# Altium project DM1097_R0M0E0.PrjPcb (part 3 of 7)
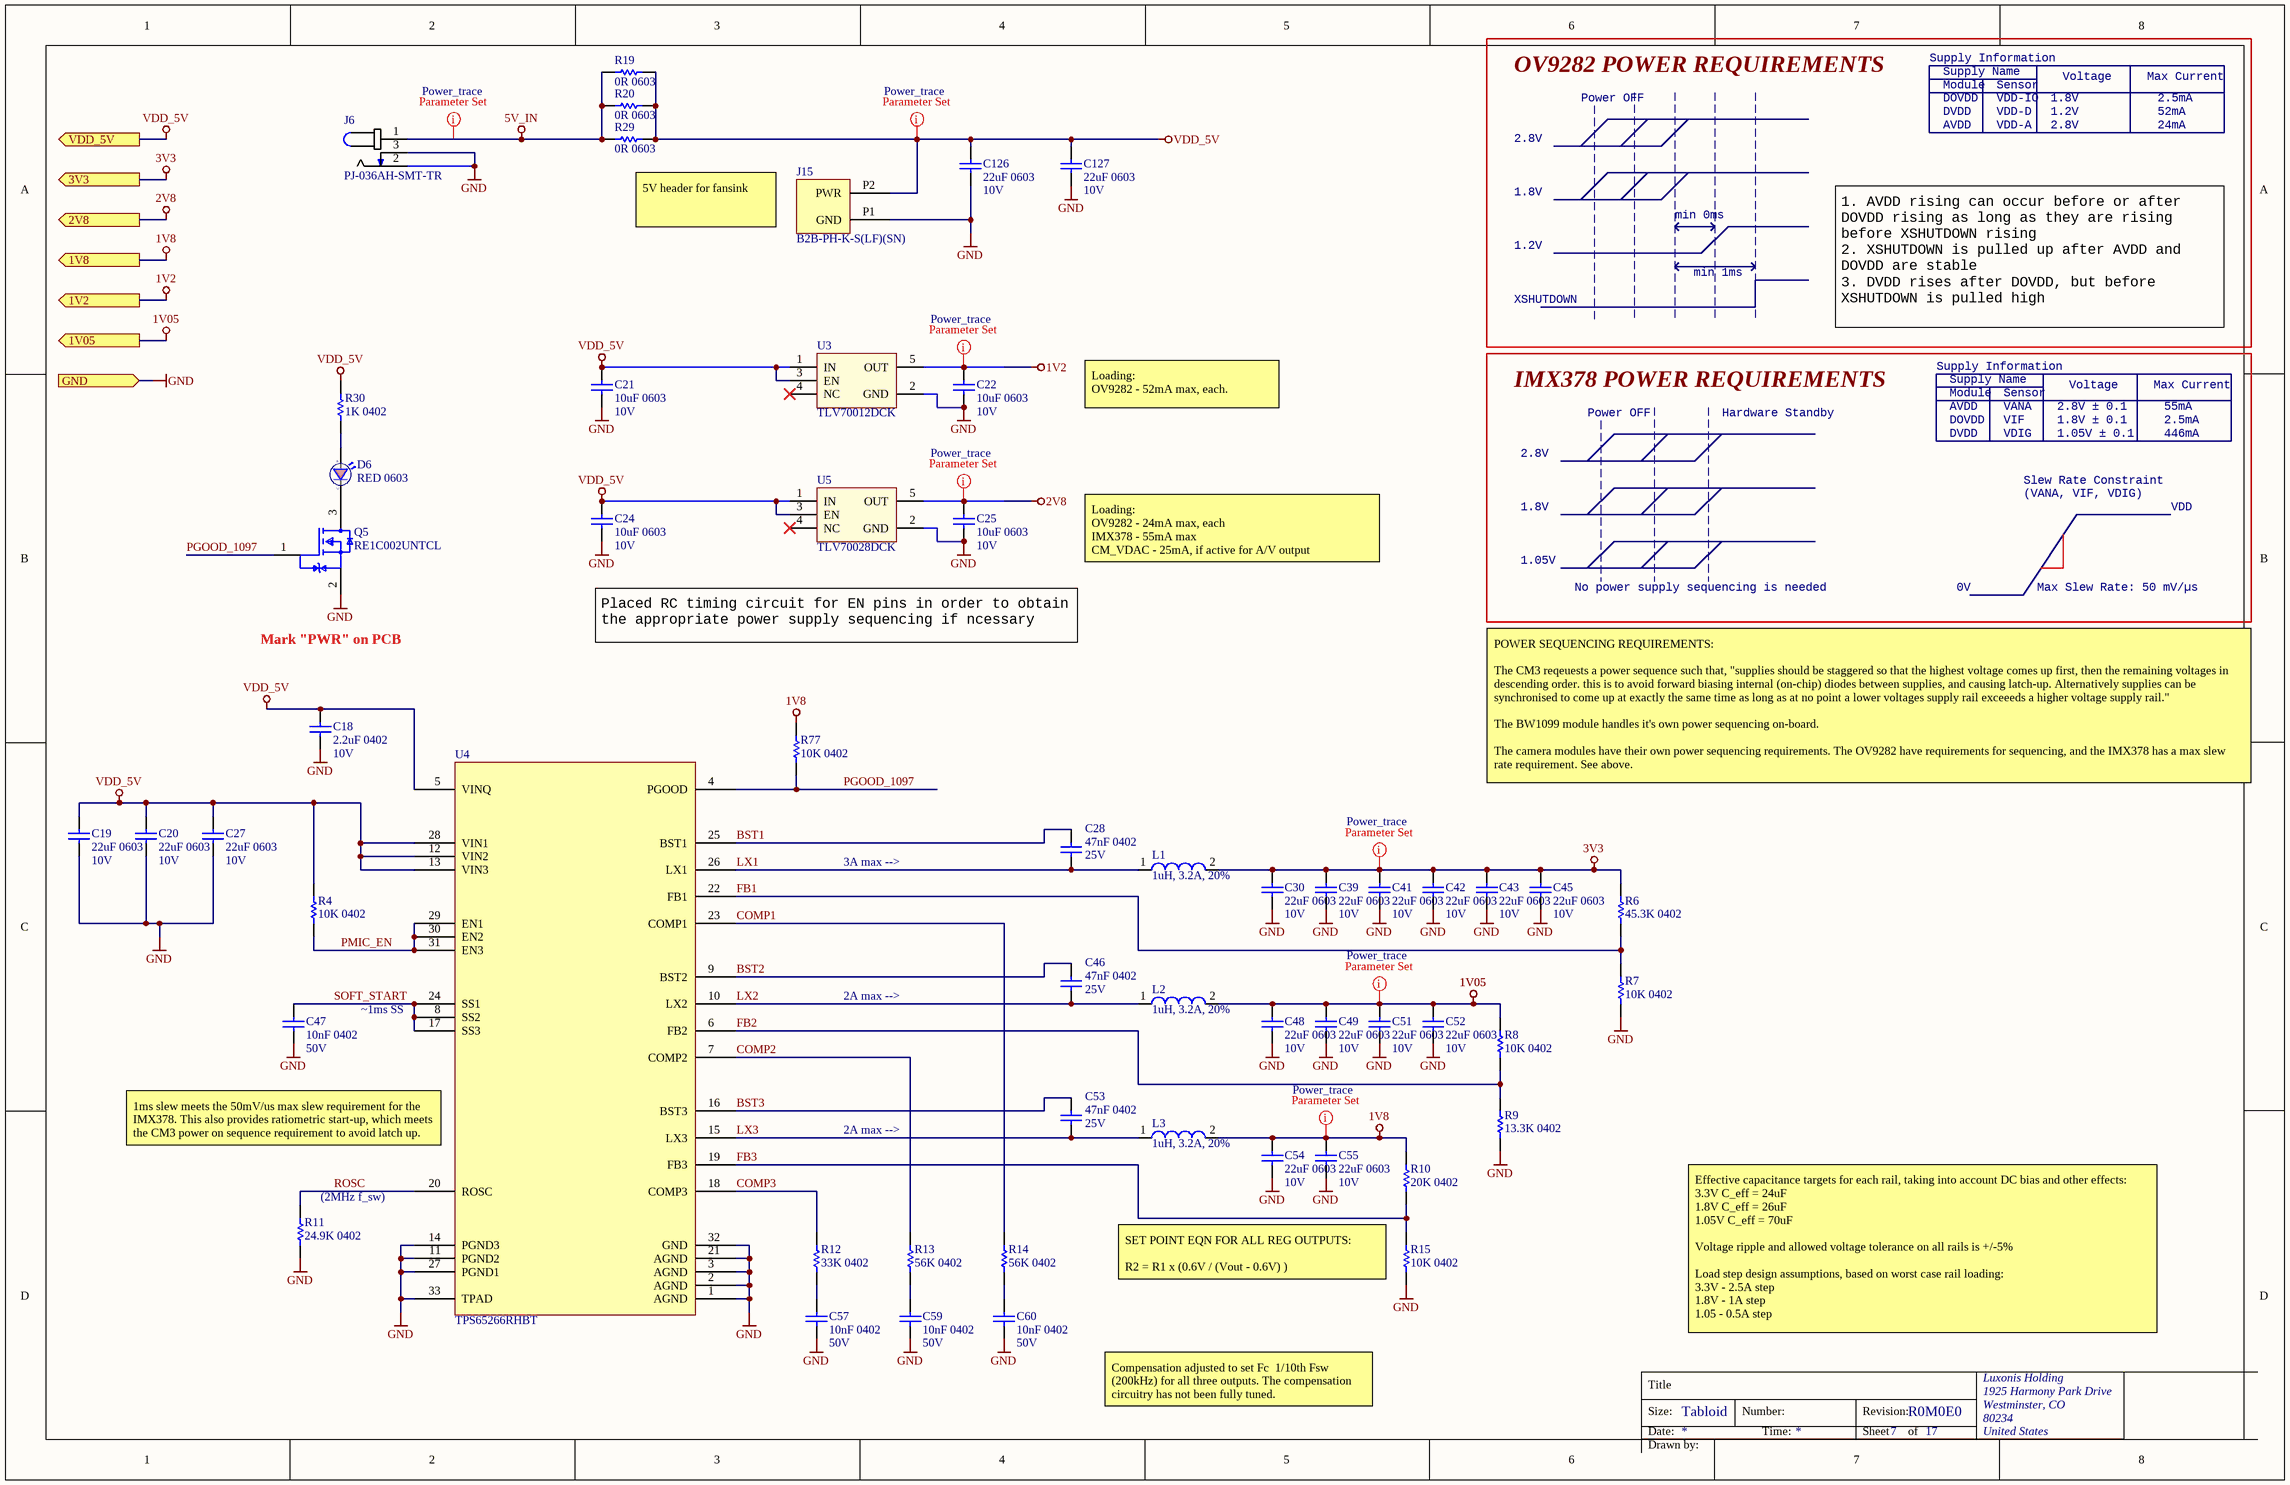
[diagram p12: DM1097_Power_Supply.SchDoc]

## Sheet DM1097_Power_Supply.SchDoc: =project_title (continued)

### Library data of the parts (continued)
U3 = TLV70012DCK: IC REG LINEAR 1.2V 200MA SC70-5; Manufacturer 1: Texas Instruments; Manufacturer Part Number 1: TLV70012DCKR; Max Power Dissipation: 320mW; Number of Outputs: 1; Dropout Voltage: 175mV; Max Input Voltage: 5.5V; Min Input Voltage: 2V; Min Current Limit: 220mA; Polarity: Positive; Accuracy: 2%; Quiescent Current: 30uA; Output Type: Fixed; Supplier 1: Digi-Key; Stock 1: 8389; Pricing 1: 1=0.48000, 10=0.40900, 100=0.30570, 500=0.24020, 1000=0.18561 (USD); RoHS: Yes; Case/Package: SC; Number of Pins: 5; Contact Plating: Gold; Min Operating Temperature: -40°C; Max Operating Temperature: 125°C; Output Voltage: 1.2V; Packaging: Tape and Reel; Output Current: 200mA; Package Quantity: 1; Max Output Current: 200mA; Number of Regulators: 1; Power Dissipation: 320mW; Min Output Voltage: 1.2V; Output Voltage Accuracy: 2%; Max Output Voltage: 1.2V; Nominal Output Voltage: 1.2V; Radiation Hardening: No; Lead Free: Lead Free; REACH SVHC: No SVHC; ComponentLink1URL: https://datasheet.ciiva.com/26909/tlv70012dckr-26909420.pdf?src-supplier=IIIC; ComponentLink1Description: https://datasheet.ciiva.com/26909/tlv70012dckr-26909420.pdf?src-supplier=IIIC; ComponentLink2URL: https://datasheet.ciiva.com/46448/1836520-46448747.pdf?src-supplier=Element14; ComponentLink2Description: https://datasheet.ciiva.com/46448/1836520-46448747.pdf?src-supplier=Element14; Supplier Part Number 1: 296-27438-1-ND; Supplier 2: TI store; Manufacturer 2: Texas Instruments; Manufacturer Part Number 2: TLV70012DCKT; Stock 2: 250; Pricing 2: 1=0.43000, 10=0.38000, 25=0.35000, 100=0.30000, 250=0.27000, 500=0.21000, 750=0.16000, 1000=0.14000 (USD); ComponentLink3URL: http://components.arrow.com/part/dataview/48874348S9524109N7713?src-supplier=Arrow; ComponentLink3Description: http://components.arrow.com/part/dataview/48874348S9524109N7713?src-supplier=Arrow; ComponentLink4URL: http://components.arrow.com/part/dataview/0323_02210905?src-supplier=Arrow+Europe; ComponentLink4Description: http://components.arrow.com/part/dataview/0323_02210905?src-supplier=Arrow+Europe; ComponentLink5URL: http://www.ti.com/general/docs/lit/getliterature.tsp?genericPartNumber=TLV700&&fileType=pdf&src-supplier=Avnet; ComponentLink5Description: http://www.ti.com/general/docs/lit/getliterature.tsp?genericPartNumber=TLV700&&fileType=pdf&src-supplier=Avnet; ComponentLink6URL: http://focus.ti.com/lit/ds/symlink/tlv70033.pdf?src-supplier=Avnet; ComponentLink6Description: http://focus.ti.com/lit/ds/symlink/tlv70033.pdf?src-supplier=Avnet; ComponentLink7URL: http://www.ti.com/lit/ds/slvsa00e/slvsa00e.pdf?src-supplier=Digi-Key; ComponentLink7Description: http://www.ti.com/lit/ds/slvsa00e/slvsa00e.pdf?src-supplier=Digi-Key; ComponentLink8URL: http://www.ti.com/litv/slvsa00d?src-supplier=Mouser; ComponentLink8Description: http://www.ti.com/litv/slvsa00d?src-supplier=Mouser; Supplier Part Number 2: TLV70012DCKT
U4 = TPS65266RHBT: IC REG BCK ADJ 3A/2A TRPL 32VQFN Buck Switching Regulator IC Positive Adjustable 0.6V 3 Output 3A, 2A 32-VFQFN Exposed Pad; Manufacturer 1: Texas Instruments; Manufacturer: TI; Switching Frequency: 2.4MHz; Number of Outputs: 3; Min Input Voltage: 2.7V; Max Input Voltage: 6.5V; Min Output Voltage: 600mV; Synchronous Rectifier: Yes; Quiescent Current: 340uA; Manufacturer Part Number 1: TPS65266RHBT; Manufacturer PN: TPS65266; Package: 32-VQFN; Supplier 1: Digi-Key; Stock 1: 4557; Pricing 1: 1=4.01000, 10=3.59900, 100=2.94850 (USD); RoHS: Yes; Mount: Surface Mount; Case/Package: VQFN; Number of Pins: 32; Weight: 0.002547oz; Min Operating Temperature: -40°C; Max Operating Temperature: 85°C; Packaging: Tape and Reel; Output Current: 2A; Package Quantity: 250; Max Output Voltage: 6.5V; Operating Supply Voltage: 6.5V; Output Type: Adjustable; Output Configuration: Positive; Current - Output 1: 3A; Current - Output 2: 2A; Lead Free: Lead Free; REACH SVHC: No SVHC; ComponentLink1URL: http://www.ti.com/general/docs/lit/getliterature.tsp?genericPartNumber=TPS65266&&fileType=pdf&src-supplier=Element14; ComponentLink1Description: http://www.ti.com/general/docs/lit/getliterature.tsp?genericPartNumber=TPS65266&&fileType=pdf&src-supplier=Element14; ComponentLink2URL: http://www.ti.com/general/docs/lit/getliterature.tsp?genericPartNumber=TPS65266&amp;&amp;fileType=pdf&src-supplier=Farnell; ComponentLink2Description: http://www.ti.com/general/docs/lit/getliterature.tsp?genericPartNumber=TPS65266&amp;&amp;fileType=pdf&src-supplier=Farnell; ComponentLink3URL: http://www.ti.com/general/docs/lit/getliterature.tsp?genericPartNumber=TPS65266&&fileType=pdf&src-supplier=Farnell; ComponentLink3Description: http://www.ti.com/general/docs/lit/getliterature.tsp?genericPartNumber=TPS65266&&fileType=pdf&src-supplier=Farnell; ComponentLink4URL: http://www.ti.com/lit/ds/symlink/tps65266.pdf?src-supplier=Digi-Key; ComponentLink4Description: http://www.ti.com/lit/ds/symlink/tps65266.pdf?src-supplier=Digi-Key; ComponentLink5URL: http://www.ti.com/lit/gpn/tps65266?src-supplier=Mouser; ComponentLink5Description: http://www.ti.com/lit/gpn/tps65266?src-supplier=Mouser; ComponentLink6URL: http://www.ti.com/general/docs/lit/getliterature.tsp?genericPartNumber=TPS65266&&fileType=pdf&src-supplier=Avnet; ComponentLink6Description: http://www.ti.com/general/docs/lit/getliterature.tsp?genericPartNumber=TPS65266&&fileType=pdf&src-supplier=Avnet; Supplier Part Number 1: 296-38685-1-ND; Supplier 2: TI store; Supplier 3: Mouser; Supplier Part Number 2: TPS65266RHBT; Supplier Part Number 3: 595-TPS65266RHBT
U5 = TLV70028DCK: IC REG LINEAR 2.8V 200MA SC70-5 Linear Voltage Regulator IC  1 Output  200mA SC-70-5; Manufacturer 1: Texas Instruments; Manufacturer Part Number 1: TLV70028DCKT; Dropout Voltage: 175mV; Number of Outputs: 1; Max Power Dissipation: 320mW; Max Input Voltage: 5.5V; Min Input Voltage: 2V; Min Current Limit: 220mA; Polarity: Positive; Quiescent Current: 30uA; Accuracy: 2%; Output Type: Fixed; Nominal Supply Current: 31uA; Supplier 1: Digi-Key; Stock 1: 832; Pricing 1: 1=0.55000, 10=0.46700, 100=0.34900 (USD); RoHS: Yes; Case/Package: SC; Number of Pins: 5; Contact Plating: Gold; Min Operating Temperature: -40°C; Max Operating Temperature: 125°C; Package Quantity: 1; Packaging: Tape and Reel; Output Current: 200mA; Output Voltage: 2.8V; Max Output Current: 200mA; Number of Regulators: 1; Power Dissipation: 320mW; Min Output Voltage: 2.8V; Output Voltage Accuracy: 2%; Max Output Voltage: 2.8V; Max Supply Voltage: 5.5V; Min Supply Voltage: 2V; Nominal Output Voltage: 2.8V; Power Rating: 320mW; Termination: SMD/SMT; Length: 2.15mm; Height: 1mm; Width: 1.4mm; Radiation Hardening: No; Lead Free: Lead Free; REACH SVHC: No SVHC; ComponentLink1URL: https://datasheet.ciiva.com/14149/tlv700-eng-ds-14149840.pdf?src-supplier=Distrelec; ComponentLink1Description: https://datasheet.ciiva.com/14149/tlv700-eng-ds-14149840.pdf?src-supplier=Distrelec; ComponentLink2URL: https://datasheet.ciiva.com/22700/1882059-22700172.pdf?src-supplier=Element14; ComponentLink2Description: https://datasheet.ciiva.com/22700/1882059-22700172.pdf?src-supplier=Element14; Supplier 2: Digi-Key; Manufacturer 2: Texas Instruments; Manufacturer Part Number 2: TLV70028DCKR; Stock 2: 30013; Pricing 2: 1=0.48000, 10=0.40900, 100=0.30570, 500=0.24020, 1000=0.18561 (USD); ComponentLink3URL: http://components.arrow.com/part/dataview/0323_00585634?src-supplier=Arrow+Europe; ComponentLink3Description: http://components.arrow.com/part/dataview/0323_00585634?src-supplier=Arrow+Europe; ComponentLink4URL: http://focus.ti.com/lit/ds/symlink/tlv70033.pdf?src-supplier=Avnet+Europe; ComponentLink4Description: http://focus.ti.com/lit/ds/symlink/tlv70033.pdf?src-supplier=Avnet+Europe; ComponentLink5URL: http://www.ti.com/lit/ds/slvsa00d/slvsa00d.pdf?src-supplier=Digi-Key; ComponentLink5Description: http://www.ti.com/lit/ds/slvsa00d/slvsa00d.pdf?src-supplier=Digi-Key; ComponentLink6URL: http://www.ti.com/lit/pdf/slyy050?src-supplier=Digi-Key; ComponentLink6Description: http://www.ti.com/lit/pdf/slyy050?src-supplier=Digi-Key; ComponentLink7URL: http://www.ti.com/general/docs/lit/getliterature.tsp?genericPartNumber=TLV700&&fileType=pdf&src-supplier=Avnet+Asia; ComponentLink7Description: http://www.ti.com/general/docs/lit/getliterature.tsp?genericPartNumber=TLV700&&fileType=pdf&src-supplier=Avnet+Asia; ComponentLink8URL: http://www.ti.com/general/docs/lit/getliterature.tsp?genericPartNumber=TLV700&&fileType=pdf&src-supplier=Avnet; ComponentLink8Description: http://www.ti.com/general/docs/lit/getliterature.tsp?genericPartNumber=TLV700&&fileType=pdf&src-supplier=Avnet; ComponentLink9URL: http://components.arrow.com/part/dataview/48329233S8322732N7713?src-supplier=Arrow; ComponentLink9Description: http://components.arrow.com/part/dataview/48329233S8322732N7713?src-supplier=Arrow; ComponentLink10URL: http://www.ti.com/litv/slvsa00d?src-supplier=Mouser; ComponentLink10Description: http://www.ti.com/litv/slvsa00d?src-supplier=Mouser; ComponentLink11URL: http://www.ti.com/lit/ds/slvsa00e/slvsa00e.pdf?src-supplier=Digi-Key; ComponentLink11Description: http://www.ti.com/lit/ds/slvsa00e/slvsa00e.pdf?src-supplier=Digi-Key; Supplier Part Number 1: 296-25271-1-ND; Supplier Part Number 2: 296-39279-1-ND

## Sheet DM1097_AV.SchDoc: =project_title
size Tabloid; CompanyName: Luxonis Holding; DrawnBy: David Malovrh; Organization: Luxonis Holding; Address1: 1925 Harmony Park Drive; Address2: Westminster, CO; Address3: 80234; Address4: United States; DocumentNumber: D0000200; Revision: R0M0E0; SheetNumber: 17; SheetTotal: 17
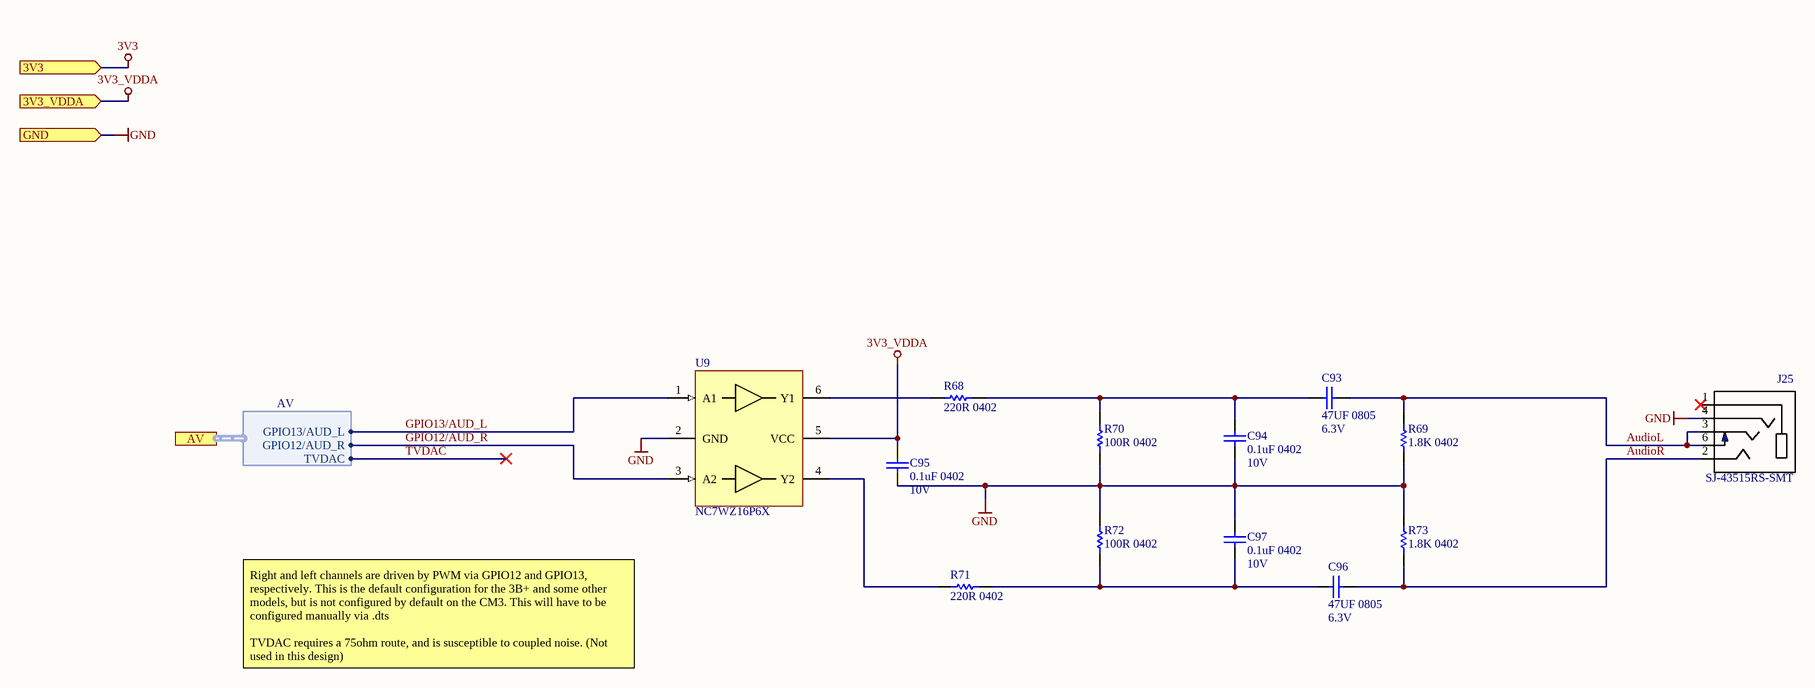
[diagram p1: DM1097_AV.SchDoc]

### Parts
C93  47UF 0805  Voltage: 6.3V  [CAPC0805(2012)145_N]
C94  0.1uF 0402  Voltage Rating: 10V  [CAPC0402(1005)70_N]
C95  0.1uF 0402  Voltage Rating: 10V  [CAPC0402(1005)70_N]
C96  47UF 0805  Voltage: 6.3V  [CAPC0805(2012)145_N]
C97  0.1uF 0402  Voltage Rating: 10V  [CAPC0402(1005)70_N]
J25  SJ-43515RS-SMT  [SJ-43515RS-SMT]
R68  220R 0402  [RESC0402(1005)_N]
R69  1.8K 0402  [RESC0402(1005)_N]
R70  100R 0402  [RESC0402(1005)_N]
R71  220R 0402  [RESC0402(1005)_N]
R72  100R 0402  [RESC0402(1005)_N]
R73  1.8K 0402  [RESC0402(1005)_N]
U9  NC7WZ16P6X  [NC7WZ16P6X]

### Ports
3V3 (in), 3V3_VDDA (in), AV (harness AV), GND (in)

### Harnesses
AV: GPIO12/AUD_R, GPIO13/AUD_L, TVDAC

### Nets
3V3: port 3V3
3V3_VDDA: C95.2 U9.5(VCC) ; port 3V3_VDDA
GND: C94.1 C95.1 C97.1 J25.4(RING2) R69.1 R70.1 R72.1 R73.1 U9.2(GND) ; port GND
AudioL: C93.1 J25.3(RING1) J25.6(RING_SWITCH) R69.2
AudioR: C96.1 J25.2(TIP) R73.2
GPIO12/AUD_R: U9.3(A2) ; port AV.GPIO12/AUD_R
GPIO13/AUD_L: U9.1(A1) ; port AV.GPIO13/AUD_L
TVDAC: port AV.TVDAC
NetC93_2: C93.2 C94.2 R68.2 R70.2
NetC96_2: C96.2 C97.2 R71.2 R72.2
NetR68_1: R68.1 U9.6(Y1)
NetR71_1: R71.1 U9.4(Y2)

Not connected (* = marked no-connect by the designer): J25 1(SLEEVE)*

### Notes on the sheet
- Right and left channels are driven by PWM via GPIO12 and GPIO13, respectively. This is the default configuration for the 3B+ and some other models, but is not configured by default on the CM3. This will have to be configured manually via .dts
  TVDAC requires a 75ohm route, and is susceptible to coupled noise. (Not used in this design)
- Title
- Size:
- Date:
- Tabloid
- Number:
- Time:
- Revision:
- Sheet
- of
- Drawn by:

### Library data of the parts
C93 C96 = GRM21BR60J476ME15L: CAP CER 47UF 6.3V X5R 0805; Manufacturer 1: Murata; Tolerance: 20%; Manufacturer Part Number 1: GRM21BR60J476ME15L; Supplier 1: Digi-Key; Stock 1: 16165; Pricing 1: 1=0.48000, 10=0.33900, 100=0.22360, 500=0.16560, 1000=0.14076 (USD); RoHS: Yes; Mount: Surface Mount; Case/Package: 0805; Weight: 0.000335oz; Case Code (Metric): 2012; Case Code (Imperial): 0805; Min Operating Temperature: -55°C; Max Operating Temperature: 85°C; Voltage Rating: 6.3V; Packaging: Tape and Reel; Capacitance: 47uF; Voltage Rating (DC): 6.3V; Package Quantity: 3000; Termination: SMD/SMT; Dielectric: X5R; Length: 2mm; Height: 1.25mm; Width: 0.049inch; Depth: 1.25mm; Thickness: 0.057inch; Lead Free: Lead Free; REACH SVHC: No SVHC; ComponentLink1URL: https://datasheet.ciiva.com/46444/1754700-46444997.pdf?src-supplier=Element14; ComponentLink1Description: https://datasheet.ciiva.com/46444/1754700-46444997.pdf?src-supplier=Element14; Supplier 2: Newark; Supplier 3: Mouser; Supplier Part Number 1: 490-9960-1-ND; Supplier Part Number 2: 40X5890; Supplier Part Number 3: 81-GRM21BR60J476ME5L
C94 C95 C97 = GRM155R71A104JA01D: CAP CER 0.1UF 10V X7R 0402 5%; Manufacturer 1: Murata; Capacitance: 100nF; Manufacturer Part Number 1: GRM155R71A104JA01D; Supplier 1: Digi-Key; Stock 1: 1346709; Pricing 1: 1=0.10000, 10=0.02500, 100=0.01130, 500=0.00806, 1000=0.00633, 2500=0.00575, 5000=0.00529 (USD); RoHS: Yes; Mount: Surface Mount; Case/Package: 0402; Case Code (Imperial): 0402; Case Code (Metric): 1005; Min Operating Temperature: -55°C; Max Operating Temperature: 125°C; Tolerance: 5%; Packaging: Tape and Reel; Voltage Rating (DC): 10V; Dielectric: X7R; Package Quantity: 10000; Termination: SMD/SMT; Length: 1mm; Height: 0.5mm; Width: 0.02inch; Thickness: 0.022inch; Depth: 0.5mm; Radiation Hardening: No; Lead Free: Lead Free; ComponentLink1URL: https://datasheet.ciiva.com/5411/product-5411135.pdf?src-supplier=Mouser; ComponentLink1Description: https://datasheet.ciiva.com/5411/product-5411135.pdf?src-supplier=Mouser; ComponentLink2URL: https://datasheet.ciiva.com/11618/c02e-11618821.pdf?src-supplier=Avnet; ComponentLink2Description: https://datasheet.ciiva.com/11618/c02e-11618821.pdf?src-supplier=Avnet; Supplier Part Number 1: 490-10777-1-ND
J25 = SJ-43515RS-SMT: CONN JACK 4COND 3.5MM SMD R/A; Manufacturer 1: CUI; Manufacturer Part Number 1: SJ-43515RS-SMT-TR; Gender: Female; Shielding: Unshielded; Number of Conductors: 4; Number of Ports: 1; Current Rating: 1A; Value: *; Supplier 1: Mouser; Stock 1: 7368; Pricing 1: 1=1.07000, 10=0.93900, 50=0.84700, 100=0.81000, 1000=0.58900, 10000=0.53400 (USD); Mount: Surface Mount; Case/Package: SMD/SMT; Color: Black; Contact Plating: Silver; Packaging: Tape and Reel; Connector Type: Jack; Orientation: Horizontal; Termination: Solder; ComponentLink1URL: https://datasheet.ciiva.com/7368/sj-4351x-smt-series-7368764.pdf?src-supplier=Digi-Key; ComponentLink1Description: https://datasheet.ciiva.com/7368/sj-4351x-smt-series-7368764.pdf?src-supplier=Digi-Key; ComponentLink2URL: https://datasheet.ciiva.com/7368/sj-4351x-smt-series-7368767.pdf?src-supplier=Digi-Key; ComponentLink2Description: https://datasheet.ciiva.com/7368/sj-4351x-smt-series-7368767.pdf?src-supplier=Digi-Key; ComponentLink3URL: http://datasheet.octopart.com/SJ-43515RS-SMT-TR-CUI-datasheet-103775270.pdf?src-supplier=CUI; ComponentLink3Description: http://datasheet.octopart.com/SJ-43515RS-SMT-TR-CUI-datasheet-103775270.pdf?src-supplier=CUI; ComponentLink4URL: http://datasheet.octopart.com/SJ-43515RS-SMT-TR-CUI-datasheet-136901581.pdf?src-supplier=CUI; ComponentLink4Description: http://datasheet.octopart.com/SJ-43515RS-SMT-TR-CUI-datasheet-136901581.pdf?src-supplier=CUI; ComponentLink5URL: http://datasheet.octopart.com/SJ-43515RS-SMT-TR-CUI-datasheet-103114024.pdf?src-supplier=Electro+Sonic; ComponentLink5Description: http://datasheet.octopart.com/SJ-43515RS-SMT-TR-CUI-datasheet-103114024.pdf?src-supplier=Electro+Sonic; ComponentLink6URL: http://datasheet.octopart.com/SJ-43515RS-SMT-TR-CUI-datasheet-13290545.pdf?src-supplier=Future+Electronics; ComponentLink6Description: http://datasheet.octopart.com/SJ-43515RS-SMT-TR-CUI-datasheet-13290545.pdf?src-supplier=Future+Electronics; ComponentLink7URL: http://datasheet.octopart.com/SJ-43515RS-SMT-TR-CUI-datasheet-102990244.pdf?src-supplier=Future+Electronics; ComponentLink7Description: http://datasheet.octopart.com/SJ-43515RS-SMT-TR-CUI-datasheet-102990244.pdf?src-supplier=Future+Electronics; ComponentLink8URL: http://datasheet.octopart.com/SJ-43515RS-SMT-TR-CUI-datasheet-103078434.pdf?src-supplier=Future+Electronics; ComponentLink8Description: http://datasheet.octopart.com/SJ-43515RS-SMT-TR-CUI-datasheet-103078434.pdf?src-supplier=Future+Electronics; Supplier Part Number 1: 490-SJ43515RS-SMT-TR
R68 R71 = RC0402FR-07220RL: RES SMD 220 OHM 1% 1/16W 0402; Manufacturer 1: Yageo; Voltage Rating: 50V; Temperature Coefficient: 100ppm/°C; Power Rating: 62.5mW; Max Power Dissipation: 63mW; Manufacturer Part Number 1: RC0402FR-07220RL; Supplier 1: Digi-Key; Stock 1: 2196434; Pricing 1: 1=0.10000, 10=0.01600, 100=0.00640, 1000=0.00289, 2500=0.00251, 5000=0.00207 (USD); RoHS: Yes; Case/Package: 0402; Number of Pins: 2; Case Code (Imperial): 0402; Case Code (Metric): 1005; Min Operating Temperature: -55°C; Max Operating Temperature: 155°C; Tolerance: 1%; Packaging: Tape and Reel; Package Quantity: 1; Termination: SMD/SMT; Resistance: 220R; Composition: Thick Film; Voltage Rating (DC): 50V; Military Standard: Not; Number of Terminations: 2; Features: Moisture Resistant; Length: 1mm; Height: 0.016inch; Width: 0.02inch; Depth: 0.5mm; REACH SVHC: No SVHC; Lead Free: Lead Free; ComponentLink1URL: https://datasheet.ciiva.com/11819/0900766b80c66297-11819466.pdf?src-supplier=RSComponents; ComponentLink1Description: https://datasheet.ciiva.com/11819/0900766b80c66297-11819466.pdf?src-supplier=RSComponents; ComponentLink2URL: https://datasheet.ciiva.com/2453/pyu-r-int-thick-7-2453460.pdf?src-supplier=Digi-Key; ComponentLink2Description: https://datasheet.ciiva.com/2453/pyu-r-int-thick-7-2453460.pdf?src-supplier=Digi-Key; ComponentLink3URL: https://datasheet.ciiva.com/2453/pyu-r-int-thick-7-2453461.pdf?src-supplier=Digi-Key; ComponentLink3Description: https://datasheet.ciiva.com/2453/pyu-r-int-thick-7-2453461.pdf?src-supplier=Digi-Key; ComponentLink4URL: https://datasheet.ciiva.com/2453/pyu-r-int-thick-7-2453462.pdf?src-supplier=Digi-Key; ComponentLink4Description: https://datasheet.ciiva.com/2453/pyu-r-int-thick-7-2453462.pdf?src-supplier=Digi-Key; ComponentLink5URL: https://datasheet.ciiva.com/16746/pyu-rc0402-51-rohs-l-6-r-16746831.pdf?src-supplier=Future+Electronics; ComponentLink5Description: https://datasheet.ciiva.com/16746/pyu-rc0402-51-rohs-l-6-r-16746831.pdf?src-supplier=Future+Electronics; Supplier 2: Mouser; Supplier Part Number 1: 311-220LRCT-ND; Supplier Part Number 2: 603-RC0402FR-07220RL
R69 R73 = RC0402FR-071K8L: RES SMD 1.8K OHM 1% 1/16W 0402; Manufacturer 1: Yageo; Resistance: 1.8kR; Temperature Coefficient: 100ppm/°C; Power Rating: 63mW; Voltage Rating: 50V; Manufacturer Part Number 1: RC0402FR-071K8L; Supplier 1: Digi-Key; Stock 1: 1041820; Pricing 1: 1=0.10000, 10=0.01600, 100=0.00640, 1000=0.00289, 2500=0.00251, 5000=0.00207 (USD); RoHS: Yes; Case/Package: 0402; Case Code (Imperial): 0402; Case Code (Metric): 1005; Min Operating Temperature: -55°C; Max Operating Temperature: 155°C; Tolerance: 1%; Packaging: Tape and Reel; Composition: Thick Film; Package Quantity: 1; Termination: SMD/SMT; Number of Terminations: 2; Max Power Dissipation: 63mW; Military Standard: Not; Features: Moisture Resistant; Working Voltage: 50V; Length: 1mm; Height: 0.016inch; Width: 0.02inch; Depth: 0.5mm; Lead Free: Lead Free; REACH SVHC: Unknown; ComponentLink1URL: https://datasheet.ciiva.com/11819/0900766b80c66297-11819472.pdf?src-supplier=RSComponents; ComponentLink1Description: https://datasheet.ciiva.com/11819/0900766b80c66297-11819472.pdf?src-supplier=RSComponents; ComponentLink2URL: https://datasheet.ciiva.com/2453/pyu-r-int-thick-7-2453530.pdf?src-supplier=Digi-Key; ComponentLink2Description: https://datasheet.ciiva.com/2453/pyu-r-int-thick-7-2453530.pdf?src-supplier=Digi-Key; ComponentLink3URL: https://datasheet.ciiva.com/7849/1018594-7849868.pdf?src-supplier=Element14; ComponentLink3Description: https://datasheet.ciiva.com/7849/1018594-7849868.pdf?src-supplier=Element14; ComponentLink4URL: https://datasheet.ciiva.com/16744/pyu-rc0402-51-rohs-l-6-r-16744223.pdf?src-supplier=Future+Electronics; ComponentLink4Description: https://datasheet.ciiva.com/16744/pyu-rc0402-51-rohs-l-6-r-16744223.pdf?src-supplier=Future+Electronics; ComponentLink5URL: https://datasheet.ciiva.com/7849/1018594-7849867.pdf?src-supplier=Element14; ComponentLink5Description: https://datasheet.ciiva.com/7849/1018594-7849867.pdf?src-supplier=Element14; ComponentLink6URL: https://datasheet.ciiva.com/12667/pyu-rc0402-51-rohs-l-6-r-12667431.pdf?src-supplier=Mouser; ComponentLink6Description: https://datasheet.ciiva.com/12667/pyu-rc0402-51-rohs-l-6-r-12667431.pdf?src-supplier=Mouser; ComponentLink7URL: https://datasheet.ciiva.com/2453/pyu-r-int-thick-7-2453529.pdf?src-supplier=Digi-Key; ComponentLink7Description: https://datasheet.ciiva.com/2453/pyu-r-int-thick-7-2453529.pdf?src-supplier=Digi-Key; ComponentLink8URL: https://datasheet.ciiva.com/2453/pyu-r-int-thick-7-2453531.pdf?src-supplier=Digi-Key; ComponentLink8Description: https://datasheet.ciiva.com/2453/pyu-r-int-thick-7-2453531.pdf?src-supplier=Digi-Key; Supplier 2: Mouser; Supplier Part Number 2: 603-RC0402FR-071K8L; Supplier Part Number 1: 311-1.80KLRCT-ND
R70 R72 = RC0402FR-07100RL: RES SMD 100 OHM 1% 1/16W 0402; Manufacturer 1: Yageo; Temperature Coefficient: 100ppm/°C; Power Rating: 62.5mW; Voltage Rating: 50V; Manufacturer Part Number 1: RC0402FR-07100RL; Supplier 1: Digi-Key; Stock 1: 45349485; Pricing 1: 1=0.10000, 10=0.01600, 100=0.00640, 1000=0.00289, 2500=0.00251, 5000=0.00207 (USD); RoHS: Yes; Case/Package: 0402; Number of Pins: 2; Case Code (Imperial): 0402; Case Code (Metric): 1005; Min Operating Temperature: -55°C; Max Operating Temperature: 155°C; Tolerance: 1%; Resistance: 100R; Packaging: Tape and Reel; Composition: Thick Film; Voltage Rating (DC): 50V; Military Standard: Not; Termination: SMD/SMT; Length: 1mm; Height: 0.32mm; Width: 0.5mm; Depth: 0.5mm; REACH SVHC: No SVHC; Lead Free: Lead Free; ComponentLink1URL: https://datasheet.ciiva.com/7849/1784430-7849810.pdf?src-supplier=Element14; ComponentLink1Description: https://datasheet.ciiva.com/7849/1784430-7849810.pdf?src-supplier=Element14; ComponentLink2URL: https://datasheet.ciiva.com/11808/0900766b80c66297-11808765.pdf?src-supplier=RSComponents; ComponentLink2Description: https://datasheet.ciiva.com/11808/0900766b80c66297-11808765.pdf?src-supplier=RSComponents; ComponentLink3URL: https://datasheet.ciiva.com/12667/pyu-rc0402-51-rohs-l-6-r-12667957.pdf?src-supplier=Mouser; ComponentLink3Description: https://datasheet.ciiva.com/12667/pyu-rc0402-51-rohs-l-6-r-12667957.pdf?src-supplier=Mouser; ComponentLink4URL: https://datasheet.ciiva.com/22747/1018594-22747511.pdf?src-supplier=Element14; ComponentLink4Description: https://datasheet.ciiva.com/22747/1018594-22747511.pdf?src-supplier=Element14; ComponentLink5URL: https://datasheet.ciiva.com/28367/1018594-28367226.pdf?src-supplier=Element14; ComponentLink5Description: https://datasheet.ciiva.com/28367/1018594-28367226.pdf?src-supplier=Element14; ComponentLink6URL: https://datasheet.ciiva.com/16740/pyu-rc0402-51-rohs-l-6-r-16740566.pdf?src-supplier=Future+Electronics; ComponentLink6Description: https://datasheet.ciiva.com/16740/pyu-rc0402-51-rohs-l-6-r-16740566.pdf?src-supplier=Future+Electronics; ComponentLink7URL: https://datasheet.ciiva.com/15189/getdatasheetpartid-329466-15189335.pdf?src-supplier=Verical; ComponentLink7Description: https://datasheet.ciiva.com/15189/getdatasheetpartid-329466-15189335.pdf?src-supplier=Verical; Supplier 2: Newark; Supplier 3: Mouser; Supplier Part Number 1: 311-100LRCT-ND; Supplier Part Number 2: 45Y6897; Supplier Part Number 3: 603-RC0402FR-07100RL
U9 = NC7WZ16P6X: IC BUF NON-INVERT 5.5V SC70-6 Buffer, Non-Inverting 2 Element 1 Bit per Element Push-Pull Output SC-88 (SC-70-6); Manufacturer 1: ON Semiconductor / Fairchild; Min Supply Voltage: 1.65V; Logic Function: Buffer,Inverting; Low Level Output Current: 32mA; High Level Output Current: -32mA; Propagation Delay: 3.8ns; Number of Elements: 2; Number of Bits per Element: 1; Max Power Dissipation: 180mW; Turn-On Delay Time: 10.6ns; Quiescent Current: 1uA; Supplier 1: Digi-Key; Manufacturer Part Number 1: NC7WZ16P6X; Stock 1: 89814; Pricing 1: 1=0.44000, 10=0.32600, 100=0.18480, 500=0.12238, 1000=0.09382 (USD); RoHS: Yes; Mount: Surface Mount; Case/Package: SC; Number of Pins: 6; Weight: 0.028g; Contact Plating: Tin,Matte; Min Operating Temperature: -40°C; Max Operating Temperature: 125°C; Max Supply Voltage: 5.5V; Packaging: Tape and Reel; Polarity: Non-Inverting; Package Quantity: 3000; Number of Input Lines: 2; Number of Output Lines: 2; Number of Channels: 2; Number of Bits: 2; Number of Inputs: 2; Number of Outputs: 2; Number of Circuits: 2; Termination: SMD/SMT; Length: 2mm; Height: 1mm; Width: 1.25mm; Radiation Hardening: No; Lead Free: Lead Free; REACH SVHC: No SVHC; ComponentLink1URL: https://datasheet.ciiva.com/5701/1725615-5701889.pdf?src-supplier=Farnell; ComponentLink1Description: https://datasheet.ciiva.com/5701/1725615-5701889.pdf?src-supplier=Farnell; ComponentLink2URL: https://datasheet.ciiva.com/15094/getdatasheetpartid-92041-15094657.pdf?src-supplier=Verical; ComponentLink2Description: https://datasheet.ciiva.com/15094/getdatasheetpartid-92041-15094657.pdf?src-supplier=Verical; ComponentLink3URL: https://datasheet.ciiva.com/27051/1028128-27051265.pdf?src-supplier=Jameco; ComponentLink3Description: https://datasheet.ciiva.com/27051/1028128-27051265.pdf?src-supplier=Jameco; ComponentLink4URL: https://datasheet.ciiva.com/8260/nc7wz16-8260101.pdf?src-supplier=Avnet; ComponentLink4Description: https://datasheet.ciiva.com/8260/nc7wz16-8260101.pdf?src-supplier=Avnet; ComponentLink5URL: https://datasheet.ciiva.com/17332/nc7wz16-17332853.pdf?src-supplier=Future+Electronics; ComponentLink5Description: https://datasheet.ciiva.com/17332/nc7wz16-17332853.pdf?src-supplier=Future+Electronics; ComponentLink6URL: https://datasheet.ciiva.com/8260/nc7wz16-8260105.pdf?src-supplier=Avnet; ComponentLink6Description: https://datasheet.ciiva.com/8260/nc7wz16-8260105.pdf?src-supplier=Avnet; ComponentLink7URL: https://datasheet.ciiva.com/26096/nc7wz16-26096508.pdf?src-supplier=Avnet+Europe; ComponentLink7Description: https://datasheet.ciiva.com/26096/nc7wz16-26096508.pdf?src-supplier=Avnet+Europe; ComponentLink8URL: https://datasheet.ciiva.com/1832/nc7wz16-1832237.pdf?src-supplier=Digi-Key; ComponentLink8Description: https://datasheet.ciiva.com/1832/nc7wz16-1832237.pdf?src-supplier=Digi-Key; ComponentLink9URL: https://datasheet.ciiva.com/7971/1725615-7971037.pdf?src-supplier=Element14; ComponentLink9Description: https://datasheet.ciiva.com/7971/1725615-7971037.pdf?src-supplier=Element14; ComponentLink10URL: https://datasheet.ciiva.com/1832/nc7wz16-1832238.pdf?src-supplier=Digi-Key; ComponentLink10Description: https://datasheet.ciiva.com/1832/nc7wz16-1832238.pdf?src-supplier=Digi-Key; ComponentLink11URL: https://datasheet.ciiva.com/1832/nc7wz16-1832239.pdf?src-supplier=Digi-Key; ComponentLink11Description: https://datasheet.ciiva.com/1832/nc7wz16-1832239.pdf?src-supplier=Digi-Key; Supplier Part Number 1: NC7WZ16P6XCT-ND

## Sheet DM1097_BootSel.SchDoc: =project_title
size Tabloid; CompanyName: Luxonis Holding; DrawnBy: David Malovrh; Organization: Luxonis Holding; Address1: 1925 Harmony Park Drive; Address2: Westminster, CO; Address3: 80234; Address4: United States; DocumentNumber: D0000200; Revision: R0M0E0; SheetNumber: 14; SheetTotal: 17
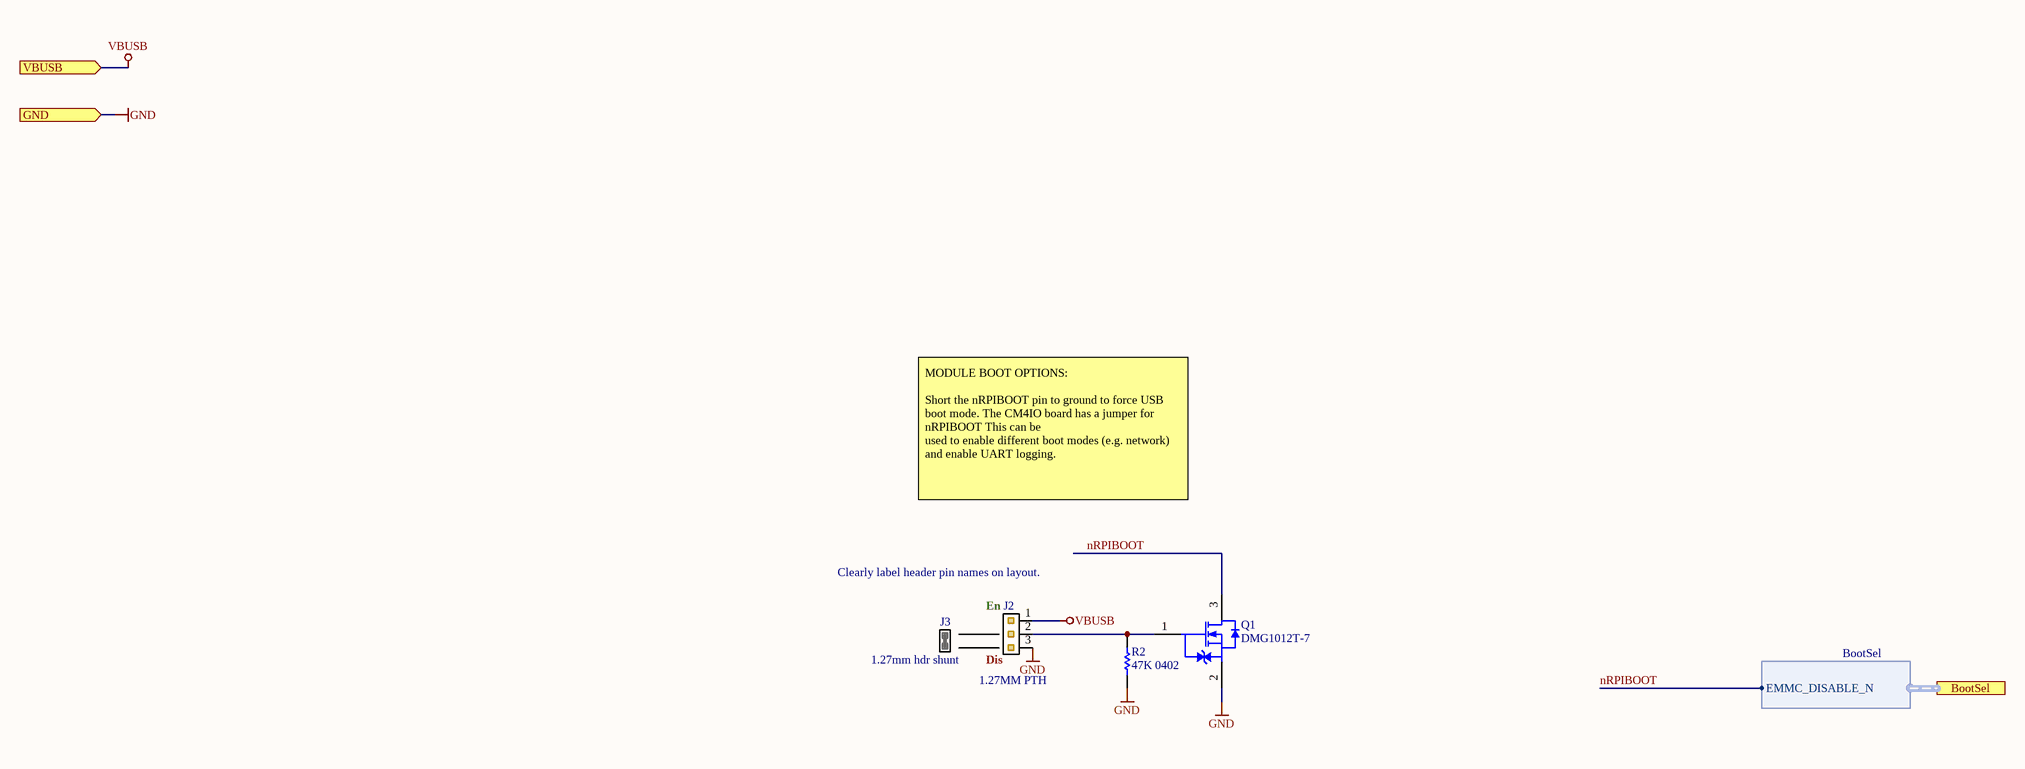
[diagram p2: DM1097_BootSel.SchDoc]

### Parts
J2  1.27MM PTH  [GRPB031VWVN-RC]
J3  1.27mm hdr shunt  [M50-1900005]
Q1  DMG1012T-7  [DMG1012T-7]
R2  47K 0402  [RESC0402(1005)_N]

### Ports
BootSel (harness BootSel), GND (in), VBUSB (in)

### Harnesses
BootSel: EMMC_DISABLE_N

### Nets
GND: J2.3 Q1.2 R2.1 ; port GND
VBUSB: J2.1 ; port VBUSB
nRPIBOOT: Q1.3 ; port BootSel.EMMC_DISABLE_N
NetJ2_2: J2.2 Q1.1 R2.2

### Notes on the sheet
- MODULE BOOT OPTIONS:
  Short the nRPIBOOT pin to ground to force USB boot mode. The CM4IO board has a jumper for nRPIBOOT This can be
  used to enable different boot modes (e.g. network) and enable UART logging.
- (near J2) Clearly label header pin names on layout.
- (near J2) En
- (near J2) Dis
- Title
- Size:
- Date:
- Tabloid
- Number:
- Time:
- Revision:
- Sheet
- of
- Drawn by:

### Library data of the parts
J2 = GRPB031VWVN-RC: CONN HEADER VERT 3POS 1.27MM; Manufacturer 1: Sullins; Number of Positions: 3; Connector Type: Male Pin; Pitch: 0.05inch; Manufacturer Part Number 1: GRPB031VWVN-RC; Supplier 1: Digi-Key; Stock 1: 114623; Pricing 1: 1=0.28000, 10=0.26100, 100=0.18300, 500=0.15688, 1000=0.13073, 5000=0.11205, 10000=0.10790 (USD); RoHS: Yes; Mount: Through Hole; Contact Plating: Gold; Package Quantity: 1; Number of Rows: 1; Packaging: Bulk; Termination: Solder; Contact Mating Length: 0.118inch; Lead Free: Lead Free; ComponentLink1URL: https://datasheet.ciiva.com/726/71-grpb-1vwvn-rc-10957-c-726649.pdf?src-supplier=Digi-Key; ComponentLink1Description: https://datasheet.ciiva.com/726/71-grpb-1vwvn-rc-10957-c-726649.pdf?src-supplier=Digi-Key; Supplier 2: Future Electronics; Supplier Part Number 1: S9014E-03-ND; Supplier Part Number 2: GRPB031VWVN-RC-BAG
J3 = M50-1900005: CONN SHUNT 1.27MM BLACK; Manufacturer 1: Harwin; Number of Positions: 2; Number of Contacts: 3; Max Current Rating: 1A; Contact Resistance: 20mR; Insulation Resistance: 1R; Voltage Rating: 500V; Manufacturer Part Number 1: M50-1900005; RoHS: Yes; Contact Plating: Gold; Contact Material: Copper Alloy; Color: Black; Housing Material: Nylon; Housing Color: Black; Min Operating Temperature: -40°C; Max Operating Temperature: 105°C; Package Quantity: 1000; Packaging: Bulk; Number of Rows: 1; Orientation: Straight; Length: 2.5mm; Height: 0.118inch; Radiation Hardening: No; REACH SVHC: No SVHC; Flammability Rating: UL94 V-0; ComponentLink1URL: https://datasheet.ciiva.com/767/m50-19x-767925.pdf?src-supplier=Digi-Key; ComponentLink1Description: https://datasheet.ciiva.com/767/m50-19x-767925.pdf?src-supplier=Digi-Key; ComponentLink2URL: https://datasheet.ciiva.com/1412/1836978-1412124.pdf?src-supplier=Element14; ComponentLink2Description: https://datasheet.ciiva.com/1412/1836978-1412124.pdf?src-supplier=Element14; Supplier 1: Digi-Key; Stock 1: 19754; Pricing 1: 1=0.33000, 10=0.30800, 25=0.26400, 50=0.22440, 100=0.21560, 250=0.19360, 500=0.18480, 1000=0.15400, 2500=0.14080 (USD); Current Rating: 1A; Pitch: 1.27mm; Depth: 3mm; Supplier Part Number 1: 952-1730-ND
Q1 = DMG1012T-7: MOSFET N-CH 20V 630MA SOT-523; Manufacturer 1: Diodes; Rds On Max: 400mR; Input Capacitance: 60.67pF; Max Power Dissipation: 280mW; Rise Time: 7.4ns; Fall Time: 12.3ns; Turn-On Delay Time: 5.1ns; Turn-Off Delay Time: 26.7ns; Gate to Source Voltage (Vgs): 6V; Number of Elements: 1; Drain to Source Resistance: 300mR; Element Configuration: Single; Threshold Voltage: 1V; FET Type: 1 N-Channel; Manufacturer Part Number 1: DMG1012T-7; Supplier 1: Digi-Key; Stock 1: 1268946; Pricing 1: 1=0.30000, 10=0.24600, 100=0.10070, 500=0.08396, 1000=0.05834 (USD); RoHS: Yes; Mount: Surface Mount; Case/Package: SOT-523; Number of Pins: 3; Weight: 7.1E-05oz; Contact Plating: Tin,Matte; Min Operating Temperature: -55°C; Max Operating Temperature: 150°C; Continuous Drain Current (ID): 630mA; Packaging: Tape and Reel; Drain to Source Voltage (Vdss): 20V; Package Quantity: 3000; Drain to Source Breakdown Voltage: 20V; Power Dissipation: 280mW; Number of Channels: 1; On-State Resistance: 400MR; Length: 1.7mm; Height: 0.8mm; Width: 0.85mm; Radiation Hardening: No; REACH SVHC: No SVHC; Lead Free: Lead Free; ComponentLink1URL: https://datasheet.ciiva.com/934/ds31783-934512.pdf?src-supplier=Digi-Key; ComponentLink1Description: https://datasheet.ciiva.com/934/ds31783-934512.pdf?src-supplier=Digi-Key; ComponentLink2URL: https://datasheet.ciiva.com/4442/ds31783-44973-4442944.pdf?src-supplier=Mouser; ComponentLink2Description: https://datasheet.ciiva.com/4442/ds31783-44973-4442944.pdf?src-supplier=Mouser; ComponentLink3URL: https://datasheet.ciiva.com/11174/ds31783-11174965.pdf?src-supplier=Avnet; ComponentLink3Description: https://datasheet.ciiva.com/11174/ds31783-11174965.pdf?src-supplier=Avnet; ComponentLink4URL: https://datasheet.ciiva.com/17324/ds31783-17324010.pdf?src-supplier=Avnet+Europe; ComponentLink4Description: https://datasheet.ciiva.com/17324/ds31783-17324010.pdf?src-supplier=Avnet+Europe; ComponentLink5URL: https://datasheet.ciiva.com/6383/ds31783-6383803.pdf?src-supplier=Digi-Key; ComponentLink5Description: https://datasheet.ciiva.com/6383/ds31783-6383803.pdf?src-supplier=Digi-Key; ComponentLink6URL: https://datasheet.ciiva.com/934/ds31783-934511.pdf?src-supplier=Digi-Key; ComponentLink6Description: https://datasheet.ciiva.com/934/ds31783-934511.pdf?src-supplier=Digi-Key; Supplier Part Number 1: DMG1012T-7DICT-ND; Supplier 2: Mouser; Supplier Part Number 2: 621-DMG1012T-7
R2 = RC0402FR-0747KL: RES SMD 47K OHM 1% 1/16W 0402; Manufacturer 1: Yageo; Resistance: 47kR; Power Rating: 62.5mW; Temperature Coefficient: 100ppm/°C; Voltage Rating: 50V; Max Power Dissipation: 63mW; Manufacturer Part Number 1: RC0402FR-0747KL; Supplier 1: Digi-Key; Stock 1: 8672261; Pricing 1: 1=0.10000, 10=0.01600, 100=0.00640, 1000=0.00289, 2500=0.00251, 5000=0.00207 (USD); RoHS: Yes; Case/Package: 0402; Case Code (Imperial): 0402; Case Code (Metric): 1005; Min Operating Temperature: -55°C; Max Operating Temperature: 155°C; Tolerance: 1%; Packaging: Tape and Reel; Composition: Thick Film; Termination: SMD/SMT; Package Quantity: 1; Number of Terminations: 2; Military Standard: Not; Features: Moisture Resistant; Length: 1mm; Height: 0.016inch; Width: 0.5mm; Depth: 0.5mm; Lead Free: Lead Free; REACH SVHC: Unknown; ComponentLink1URL: https://datasheet.ciiva.com/16793/pyu-rc0402-51-rohs-l-6-r-16793430.pdf?src-supplier=Future+Electronics; ComponentLink1Description: https://datasheet.ciiva.com/16793/pyu-rc0402-51-rohs-l-6-r-16793430.pdf?src-supplier=Future+Electronics; ComponentLink2URL: https://datasheet.ciiva.com/46412/1018594-46412839.pdf?src-supplier=Element14; ComponentLink2Description: https://datasheet.ciiva.com/46412/1018594-46412839.pdf?src-supplier=Element14; ComponentLink3URL: https://datasheet.ciiva.com/15189/getdatasheetpartid-323748-15189466.pdf?src-supplier=Verical; ComponentLink3Description: https://datasheet.ciiva.com/15189/getdatasheetpartid-323748-15189466.pdf?src-supplier=Verical; ComponentLink4URL: https://datasheet.ciiva.com/2453/pyu-r-int-thick-7-2453388.pdf?src-supplier=Digi-Key; ComponentLink4Description: https://datasheet.ciiva.com/2453/pyu-r-int-thick-7-2453388.pdf?src-supplier=Digi-Key; ComponentLink5URL: https://datasheet.ciiva.com/2453/pyu-r-int-thick-7-2453389.pdf?src-supplier=Digi-Key; ComponentLink5Description: https://datasheet.ciiva.com/2453/pyu-r-int-thick-7-2453389.pdf?src-supplier=Digi-Key; ComponentLink6URL: https://datasheet.ciiva.com/2453/pyu-r-int-thick-7-2453390.pdf?src-supplier=Digi-Key; ComponentLink6Description: https://datasheet.ciiva.com/2453/pyu-r-int-thick-7-2453390.pdf?src-supplier=Digi-Key; Supplier 2: Newark; Supplier Part Number 1: 311-47.0KLRCT-ND; Supplier Part Number 2: 26M6788

## Sheet DM1097_GPIOHDR.SchDoc: =project_title
size Tabloid; CompanyName: Luxonis Holding; DrawnBy: David Malovrh; Organization: Luxonis Holding; Address1: 1925 Harmony Park Drive; Address2: Westminster, CO; Address3: 80234; Address4: United States; DocumentNumber: D0000200; Revision: R0M0E0; SheetNumber: 11; SheetTotal: 17
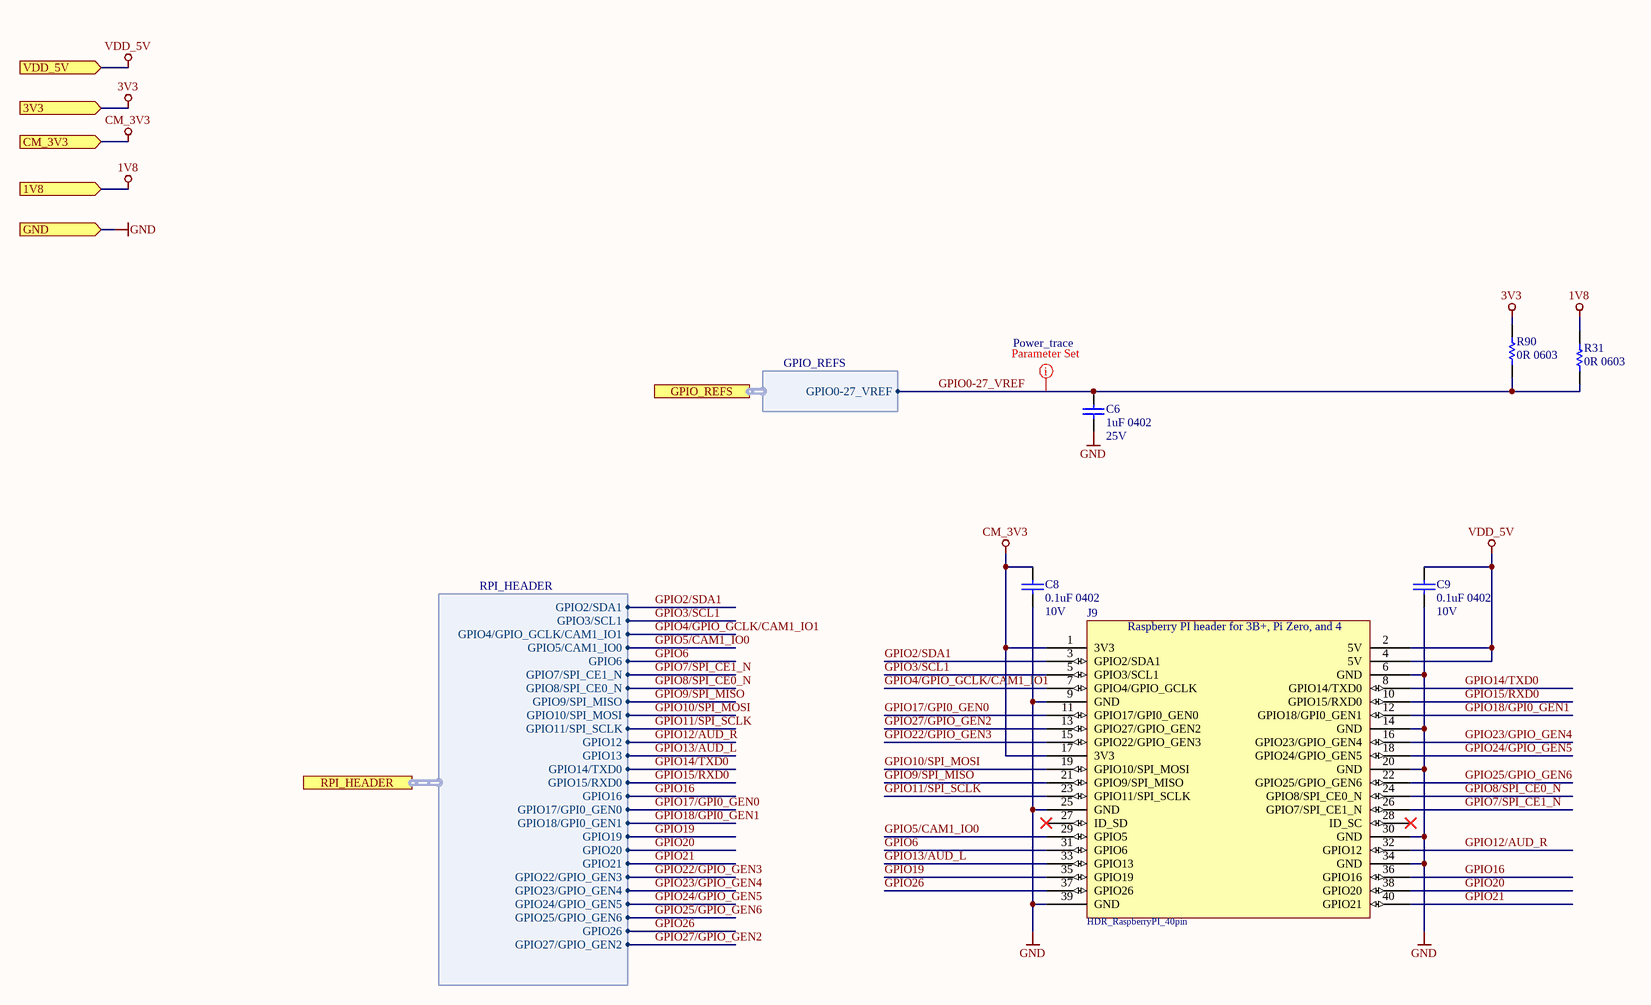
[diagram p3: DM1097_GPIOHDR.SchDoc]

### Parts
C6  1uF 0402  Voltage Rating: 25V  [CAPC0402(1005)70_N]
C8  0.1uF 0402  Voltage Rating: 10V  [CAPC0402(1005)70_N]
C9  0.1uF 0402  Voltage Rating: 10V  [CAPC0402(1005)70_N]
J9  HDR_RaspberryPI_40pin  [61304021121]
R31  0R 0603  [RESC0603(1608)_N]
R90  0R 0603  [RESC0603(1608)_N]

### Ports
1V8 (in), 3V3 (in), CM_3V3 (in), GND (in), GPIO_REFS (harness GPIO_REFS), RPI_HEADER (harness RPI_HEADER), VDD_5V (in)

### Harnesses
GPIO_REFS: GPIO0-27_VREF
RPI_HEADER: GPIO2/SDA1, GPIO3/SCL1, GPIO4/GPIO_GCLK/CAM1_IO1, GPIO5/CAM1_IO0, GPIO6, GPIO7/SPI_CE1_N, GPIO8/SPI_CE0_N, GPIO9/SPI_MISO, GPIO10/SPI_MOSI, GPIO11/SPI_SCLK, GPIO12, GPIO13, GPIO14/TXD0, GPIO15/RXD0, GPIO16, GPIO17/GPI0_GEN0, GPIO18/GPI0_GEN1, GPIO19, GPIO20, GPIO21, GPIO22/GPIO_GEN3, GPIO23/GPIO_GEN4, GPIO24/GPIO_GEN5, GPIO25/GPIO_GEN6, GPIO26, GPIO27/GPIO_GEN2

### Nets
1V8: R31.2 ; port 1V8
3V3: R90.2 ; port 3V3
CM_3V3: C8.2 J9.1(3V3) J9.17(3V3) ; port CM_3V3
GND: C6.1 C8.1 C9.1 J9.6(GND) J9.9(GND) J9.14(GND) J9.20(GND) J9.25(GND) J9.30(GND) J9.34(GND) J9.39(GND) ; port GND
VDD_5V: C9.2 J9.2(5V) J9.4(5V) ; port VDD_5V
GPIO0-27_VREF: C6.2 R31.1 R90.1 ; port GPIO_REFS.GPIO0-27_VREF
GPIO2/SDA1: J9.3(GPIO2/SDA1) ; port RPI_HEADER.GPIO2/SDA1
GPIO3/SCL1: J9.5(GPIO3/SCL1) ; port RPI_HEADER.GPIO3/SCL1
GPIO4/GPIO_GCLK/CAM1_IO1: J9.7(GPIO4/GPIO_GCLK) ; port RPI_HEADER.GPIO4/GPIO_GCLK/CAM1_IO1
GPIO5/CAM1_IO0: J9.29(GPIO5) ; port RPI_HEADER.GPIO5/CAM1_IO0
GPIO6: J9.31(GPIO6) ; port RPI_HEADER.GPIO6
GPIO7/SPI_CE1_N: J9.26(GPIO7/SPI_CE1_N) ; port RPI_HEADER.GPIO7/SPI_CE1_N
GPIO8/SPI_CE0_N: J9.24(GPIO8/SPI_CE0_N) ; port RPI_HEADER.GPIO8/SPI_CE0_N
GPIO9/SPI_MISO: J9.21(GPIO9/SPI_MISO) ; port RPI_HEADER.GPIO9/SPI_MISO
GPIO10/SPI_MOSI: J9.19(GPIO10/SPI_MOSI) ; port RPI_HEADER.GPIO10/SPI_MOSI
GPIO11/SPI_SCLK: J9.23(GPIO11/SPI_SCLK) ; port RPI_HEADER.GPIO11/SPI_SCLK
GPIO12/AUD_R: J9.32(GPIO12) ; port RPI_HEADER.GPIO12
GPIO13/AUD_L: J9.33(GPIO13) ; port RPI_HEADER.GPIO13
GPIO14/TXD0: J9.8(GPIO14/TXD0) ; port RPI_HEADER.GPIO14/TXD0
GPIO15/RXD0: J9.10(GPIO15/RXD0) ; port RPI_HEADER.GPIO15/RXD0
GPIO16: J9.36(GPIO16) ; port RPI_HEADER.GPIO16
GPIO17/GPI0_GEN0: J9.11(GPIO17/GPI0_GEN0) ; port RPI_HEADER.GPIO17/GPI0_GEN0
GPIO18/GPI0_GEN1: J9.12(GPIO18/GPI0_GEN1) ; port RPI_HEADER.GPIO18/GPI0_GEN1
GPIO19: J9.35(GPIO19) ; port RPI_HEADER.GPIO19
GPIO20: J9.38(GPIO20) ; port RPI_HEADER.GPIO20
GPIO21: J9.40(GPIO21) ; port RPI_HEADER.GPIO21
GPIO22/GPIO_GEN3: J9.15(GPIO22/GPIO_GEN3) ; port RPI_HEADER.GPIO22/GPIO_GEN3
GPIO23/GPIO_GEN4: J9.16(GPIO23/GPIO_GEN4) ; port RPI_HEADER.GPIO23/GPIO_GEN4
GPIO24/GPIO_GEN5: J9.18(GPIO24/GPIO_GEN5) ; port RPI_HEADER.GPIO24/GPIO_GEN5
GPIO25/GPIO_GEN6: J9.22(GPIO25/GPIO_GEN6) ; port RPI_HEADER.GPIO25/GPIO_GEN6
GPIO26: J9.37(GPIO26) ; port RPI_HEADER.GPIO26
GPIO27/GPIO_GEN2: J9.13(GPIO27/GPIO_GEN2) ; port RPI_HEADER.GPIO27/GPIO_GEN2

Not connected (* = marked no-connect by the designer): J9 27(ID_SD)* 28(ID_SC)*

### Layout directives
net class Power_trace: GPIO0-27_VREF

### Notes on the sheet
- Title
- Size:
- Date:
- Tabloid
- Number:
- Time:
- Revision:
- Sheet
- of
- Drawn by:
- (in symbol 61304021121_RPI_40pin) Raspberry PI header for 3B+, Pi Zero, and 4

### Library data of the parts
C6 = GRM155R61E105KA12D: CAP CER 1UF 25V X5R 0402 10%; Manufacturer 1: Murata; Material: Ceramic; Manufacturer Part Number 1: GRM155R61E105KA12D; Supplier 1: Digi-Key; Stock 1: 200653; Pricing 1: 1=0.10000, 10=0.07100, 100=0.03350, 500=0.02352, 1000=0.01947, 2500=0.01812, 5000=0.01658 (USD); RoHS: Yes; Mount: Surface Mount; Case/Package: 0402; Weight: 0.000212oz; Case Code (Metric): 1005; Case Code (Imperial): 0402; Min Operating Temperature: -55°C; Max Operating Temperature: 85°C; Tolerance: 10%; Capacitance: 1uF; Dielectric: X5R; Voltage Rating (DC): 25V; Packaging: Tape and Reel; Package Quantity: 10000; Termination: SMD/SMT; Voltage: 25V; Length: 1mm; Height: 0.5mm; Width: 0.5mm; Thickness: 0.022inch; Depth: 0.5mm; Lead Free: Lead Free; REACH SVHC: No SVHC; ComponentLink1URL: https://datasheet.ciiva.com/22732/1666664-22732122.pdf?src-supplier=Element14; ComponentLink1Description: https://datasheet.ciiva.com/22732/1666664-22732122.pdf?src-supplier=Element14; ComponentLink2URL: https://datasheet.ciiva.com/7719/1666664-7719006.pdf?src-supplier=Element14; ComponentLink2Description: https://datasheet.ciiva.com/7719/1666664-7719006.pdf?src-supplier=Element14; Supplier Part Number 1: 490-10017-1-ND; Supplier 2: Arrow; Supplier 3: TTI; Supplier Part Number 2: GRM155R61E105KA12D; Supplier Part Number 3: GRM155R61E105KA12D
C8 C9 = GRM155R71A104JA01D: as C94 on sheet DM1097_AV; Manufacturer Part Number 1: GRM155R71A104JA01D; Supplier 1: Digi-Key; Stock 1: 1346709; Pricing 1: 1=0.10000, 10=0.02500, 100=0.01130, 500=0.00806, 1000=0.00633, 2500=0.00575, 5000=0.00529 (USD); RoHS: Yes; Mount: Surface Mount; Case/Package: 0402; Case Code (Imperial): 0402; Case Code (Metric): 1005; Min Operating Temperature: -55°C; Max Operating Temperature: 125°C; Tolerance: 5%; Packaging: Tape and Reel; Voltage Rating (DC): 10V; Dielectric: X7R; Package Quantity: 10000; Termination: SMD/SMT; Length: 1mm; Height: 0.5mm; Width: 0.02inch; Thickness: 0.022inch; Depth: 0.5mm; Radiation Hardening: No; Lead Free: Lead Free; ComponentLink1URL: https://datasheet.ciiva.com/5411/product-5411135.pdf?src-supplier=Mouser; ComponentLink1Description: https://datasheet.ciiva.com/5411/product-5411135.pdf?src-supplier=Mouser; ComponentLink2URL: https://datasheet.ciiva.com/11618/c02e-11618821.pdf?src-supplier=Avnet; ComponentLink2Description: https://datasheet.ciiva.com/11618/c02e-11618821.pdf?src-supplier=Avnet; Supplier Part Number 1: 490-10777-1-ND
J9 = 61304021121_RPI_40pin: CONN HEADER VERT 40POS 2.54MM THT HDR_RaspberryPI_40pin; Manufacturer 1: Wurth Electronics; Manufacturer: Wurth Elektronik; Contact Resistance: 20mOhm; Row Number: Dual; Pin Number: 40; Withstanding Voltage: 500VAC; Gender: Male; Rated Current: 3A; Working Voltage: 250VAC; Connector Type: Male Pin; Row Spacing: 0.1inch; Manufacturer Part Number 1: 61304021121; Operating Temperature: -40to105degC; Manufacturer URL: http://www.we-online.de; Orientation: Vertical; Pitch: 2.54mm; Datasheet URL: https://katalog.we-online.de/em/datasheet/6130xx21121.pdf; Package Reference: 61304021121; Part Number: 61304021121; Packaging: Bag; Mounting Technology: THT; Publisher: WurthElektronik; Supplier 1: Digi-Key; Stock 1: 969; Pricing 1: 1=1.89000, 10=1.60200, 25=1.33520, 50=1.11300, 100=1.01200, 500=0.92000 (USD); RoHS: Yes; Mount: Through Hole; Contact Plating: Gold; Contact Material: Copper; Color: Black; Number of Rows: 2; Number of Positions: 40; Termination: Solder; Number of Contacts: 40; Contact Mating Length: 0.236inch; REACH SVHC: Unknown; ComponentLink1URL: http://www.farnell.com/datasheets/1442180.pdf?src-supplier=Farnell; ComponentLink1Description: http://www.farnell.com/datasheets/1442180.pdf?src-supplier=Farnell; ComponentLink2URL: http://www.farnell.com/datasheets/1442180.pdf?src-supplier=Element14; ComponentLink2Description: http://www.farnell.com/datasheets/1442180.pdf?src-supplier=Element14; ComponentLink3URL: http://www.farnell.com/datasheets/1442180.pdf?src-supplier=Newark; ComponentLink3Description: http://www.farnell.com/datasheets/1442180.pdf?src-supplier=Newark; ComponentLink4URL: https://katalog.we-online.de/em/datasheet/6130xx21121.pdf?src-supplier=Digi-Key; ComponentLink4Description: https://katalog.we-online.de/em/datasheet/6130xx21121.pdf?src-supplier=Digi-Key; Supplier Part Number 1: 732-5310-ND; Supplier 2: Newark; Supplier 3: Mouser; Supplier 4: Farnell; Supplier 5: Element14; Supplier Part Number 2: 20X1011; Supplier Part Number 3: 710-61304021121; Supplier Part Number 4: 2356148; Supplier Part Number 5: 2356148
R31 R90 = CRCW06030000Z0EA: RES SMD 0 OHM JUMPER 1/10W 0603 0 Ohms Jumper 0.1W, 1/10W Chip Resistor 0603 (1608 Metric) Automotive AEC-Q200 Thick Film; Manufacturer 1: Vishay; Manufacturer Part Number 1: CRCW0603-0000Z0EA; Resistance: 0mR; Power Rating: 100mW; Voltage Rating: 75V; Temperature Coefficient: 100ppm/°C; Tolerance: 5%; Current Rating: 2A; Supplier 1: Digi-Key; Stock 1: 742743; Pricing 1: 1=0.100000, 10=0.034000, 25=0.024400, 50=0.018600, 100=0.013800, 250=0.010480, 500=0.008400, 1000=0.006180 (USD); RoHS: Yes; Mount: Surface Mount; Case/Package: 0603; Weight: 7.1E-05oz; Contact Plating: Tin,Lead; Case Code (Metric): 1608; Case Code (Imperial): 0603; Min Operating Temperature: -55°C; Max Operating Temperature: 155°C; Composition: Thick Film; Termination: SMD/SMT; Packaging: Tape and Reel; Package Quantity: 1; Number of Terminations: 2; Military Standard: Not; Max Power Dissipation: 100mW; Voltage Rating (DC): 75V; Features: Automotive AEC-Q200; Working Voltage: 75V; Length: 1.55mm; Height: 0.02inch; Width: 0.033inch; Depth: 0.85mm; Radiation Hardening: No; Lead Free: Lead Free; REACH SVHC: Unknown; ComponentLink1URL: https://datasheet.ciiva.com/2461/dcrcwe3-2461968.pdf?src-supplier=Digi-Key; ComponentLink1Description: https://datasheet.ciiva.com/2461/dcrcwe3-2461968.pdf?src-supplier=Digi-Key; ComponentLink2URL: https://datasheet.ciiva.com/2461/dcrcwe3-2461969.pdf?src-supplier=Digi-Key; ComponentLink2Description: https://datasheet.ciiva.com/2461/dcrcwe3-2461969.pdf?src-supplier=Digi-Key; ComponentLink3URL: https://datasheet.ciiva.com/2461/dcrcwe3-2461970.pdf?src-supplier=Digi-Key; ComponentLink3Description: https://datasheet.ciiva.com/2461/dcrcwe3-2461970.pdf?src-supplier=Digi-Key; ComponentLink4URL: https://datasheet.ciiva.com/8340/dcrcwe3-8340197.pdf?src-supplier=Avnet; ComponentLink4Description: https://datasheet.ciiva.com/8340/dcrcwe3-8340197.pdf?src-supplier=Avnet; ComponentLink5URL: https://datasheet.ciiva.com/16941/dcrcw-16941302.pdf?src-supplier=Avnet+Europe; ComponentLink5Description: https://datasheet.ciiva.com/16941/dcrcw-16941302.pdf?src-supplier=Avnet+Europe; ComponentLink6URL: https://datasheet.ciiva.com/16199/dcrcwe3-16199063.pdf?src-supplier=Future+Electronics; ComponentLink6Description: https://datasheet.ciiva.com/16199/dcrcwe3-16199063.pdf?src-supplier=Future+Electronics; ComponentLink7URL: https://datasheet.ciiva.com/16725/70201119-16725175.pdf?src-supplier=Allied+Electronics; ComponentLink7Description: https://datasheet.ciiva.com/16725/70201119-16725175.pdf?src-supplier=Allied+Electronics; ComponentLink8URL: https://datasheet.ciiva.com/26316/fld-crcw-e3-data-en-26316615.pdf?src-supplier=Distrelec; ComponentLink8Description: https://datasheet.ciiva.com/26316/fld-crcw-e3-data-en-26316615.pdf?src-supplier=Distrelec; ComponentLink9URL: https://datasheet.ciiva.com/5544/dcrcwe3-109170-5544344.pdf?src-supplier=Mouser; ComponentLink9Description: https://datasheet.ciiva.com/5544/dcrcwe3-109170-5544344.pdf?src-supplier=Mouser; ComponentLink10URL: https://datasheet.ciiva.com/7841/1720486-7841816.pdf?src-supplier=Element14; ComponentLink10Description: https://datasheet.ciiva.com/7841/1720486-7841816.pdf?src-supplier=Element14; ComponentLink11URL: https://datasheet.ciiva.com/7841/1720486-7841817.pdf?src-supplier=Element14; ComponentLink11Description: https://datasheet.ciiva.com/7841/1720486-7841817.pdf?src-supplier=Element14; ComponentLink12URL: https://datasheet.ciiva.com/7841/125364-7841818.pdf?src-supplier=Element14; ComponentLink12Description: https://datasheet.ciiva.com/7841/125364-7841818.pdf?src-supplier=Element14; ComponentLink13URL: https://datasheet.ciiva.com/16721/70201119-16721450.pdf?src-supplier=Allied+Electronics; ComponentLink13Description: https://datasheet.ciiva.com/16721/70201119-16721450.pdf?src-supplier=Allied+Electronics; Supplier Part Number 1: 541-0.0GCT-ND

## Sheet DM1097_HUB.SchDoc: =project_title
size Tabloid; PageSetup: Record=PageOptions|CenterHorizontal=True|CenterVertical=True|PrintScale=0.73|XCorrection=1.00|YCorrection=1.00|PrintKind=0|BorderSize=5000000|LeftOffset=0|BottomOffset=0|Orientation=2|PaperLength=1000|PaperWidth=1000|Scale=100|PaperSource=7|PrintQuality=-4|MediaType=1|DitherType=10|PaperKind=A4|PrintScaleMode=1; CompanyName: Luxonis Holding; DrawnBy: David Malovrh; Organization: Luxonis Holding; Address1: 1925 Harmony Park Drive; Address2: Westminster, CO; Address3: 80234; Address4: United States; DocumentNumber: D0000200; Revision: R0M0E0; SheetNumber: 8; SheetTotal: 17
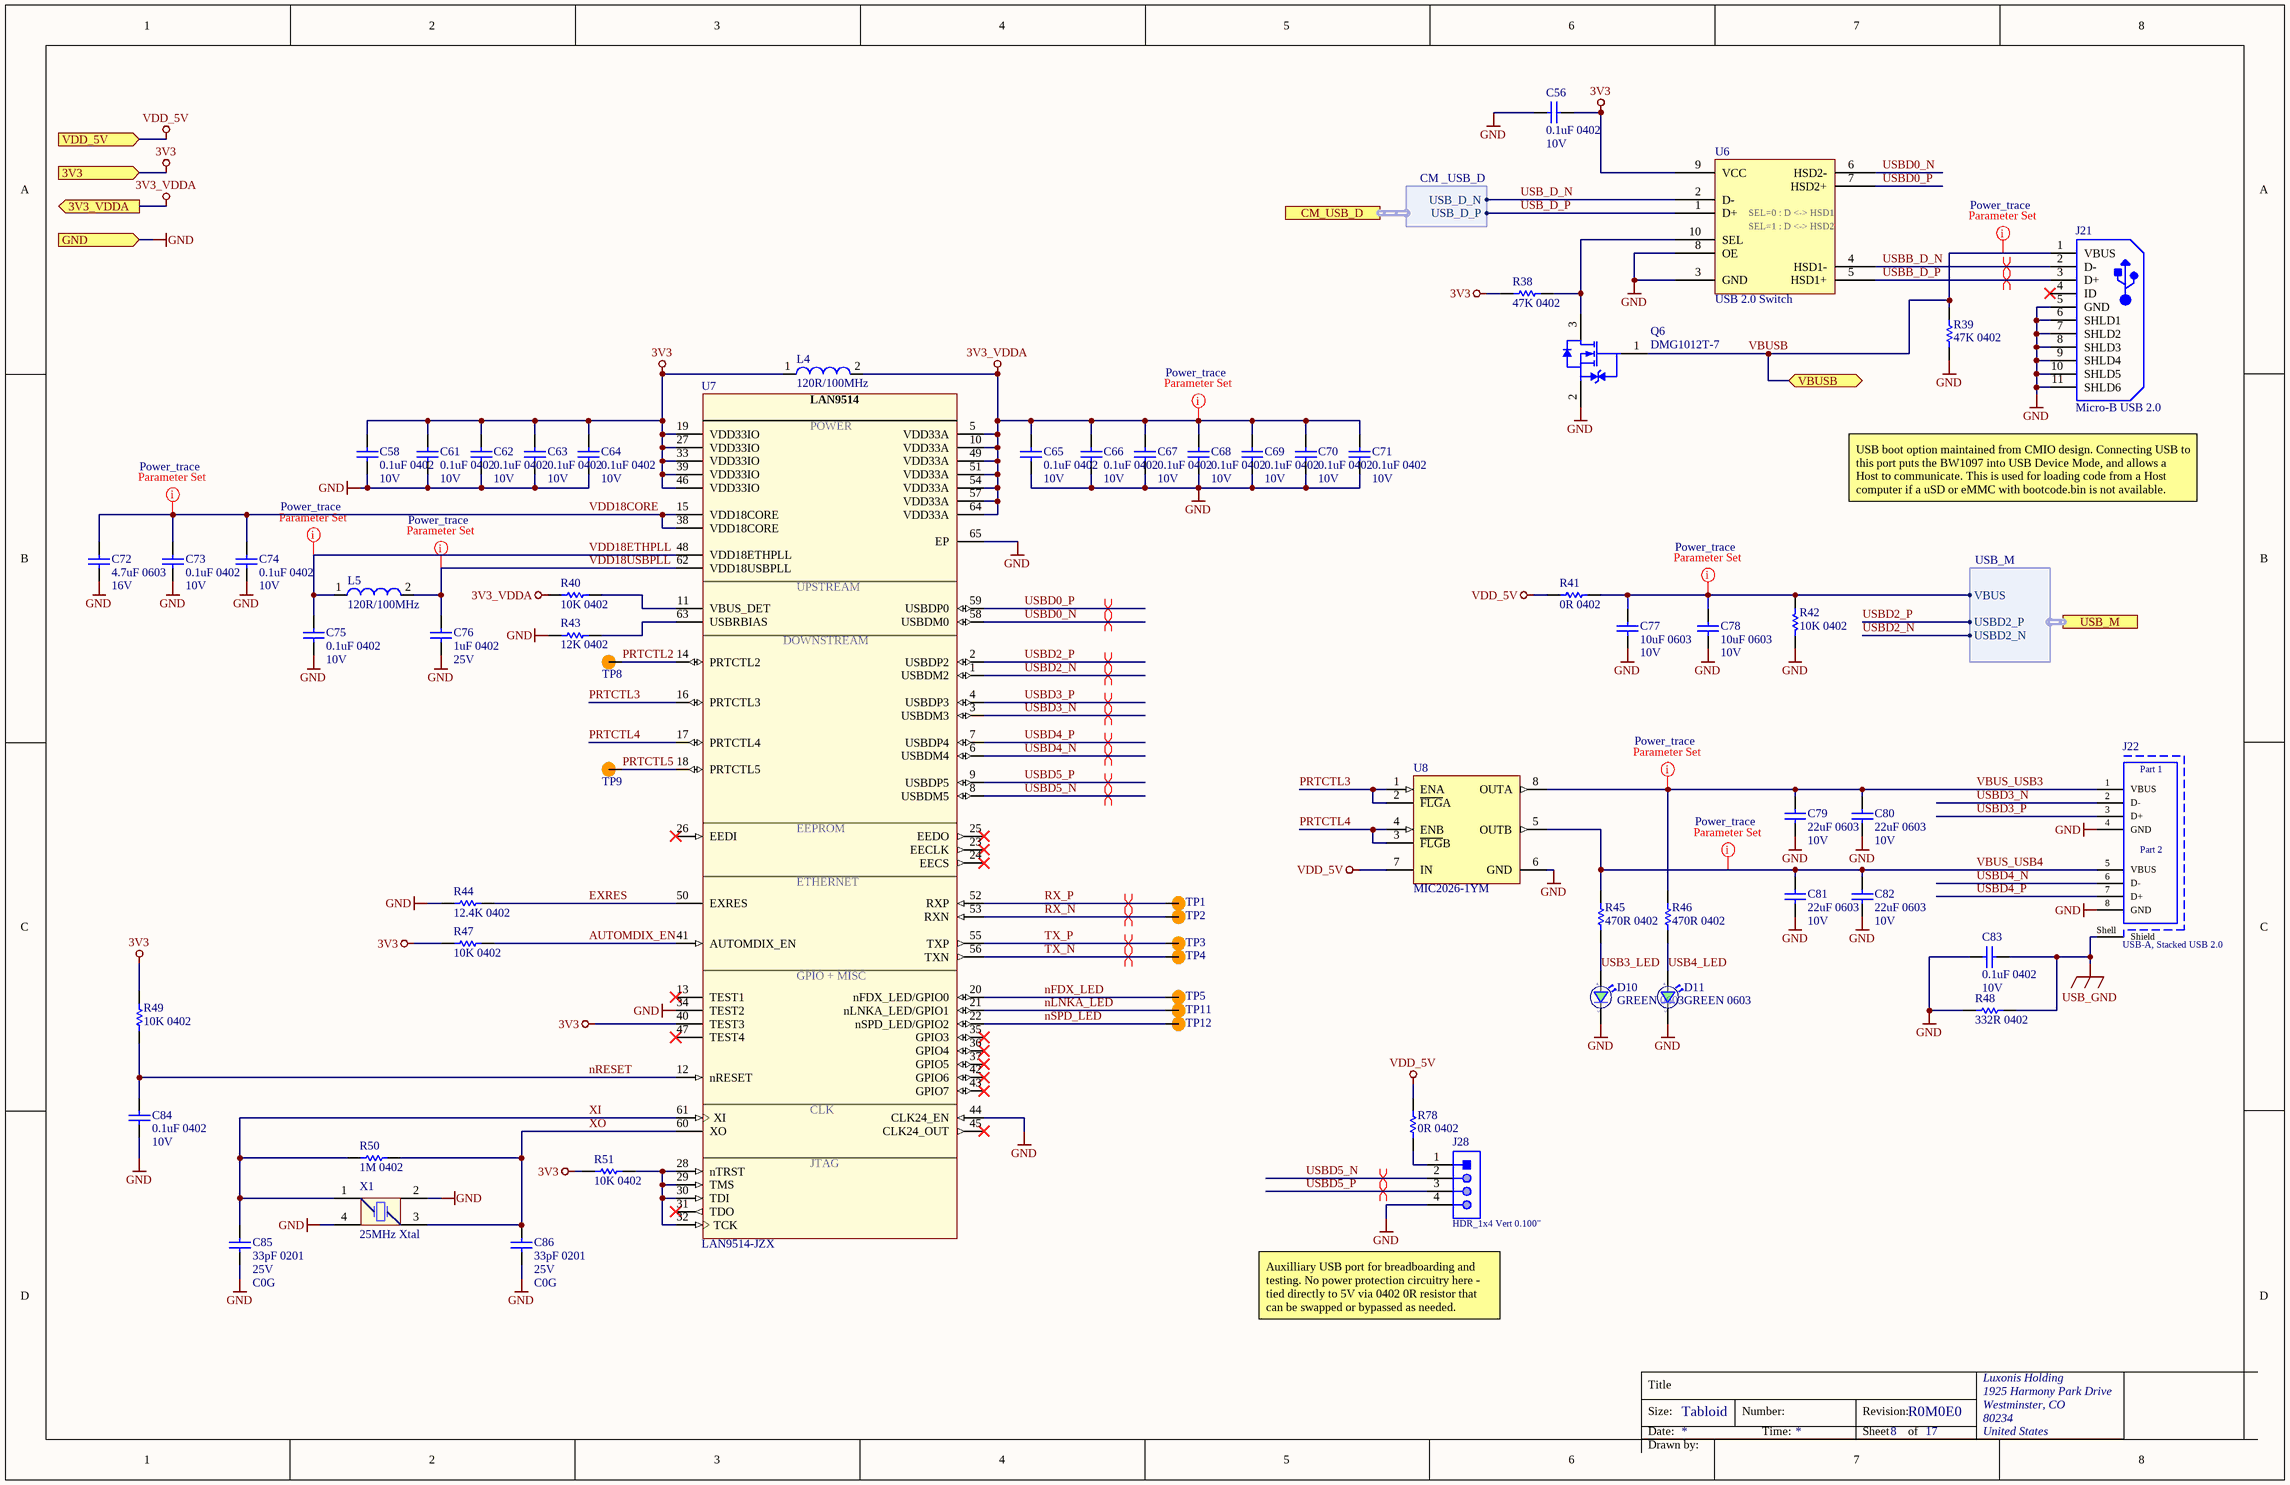
[diagram p4: DM1097_HUB.SchDoc]